# Altium schematic sheet Top Sheet.SchDoc
size A3; SheetNumber: 1; SheetTotal: 5
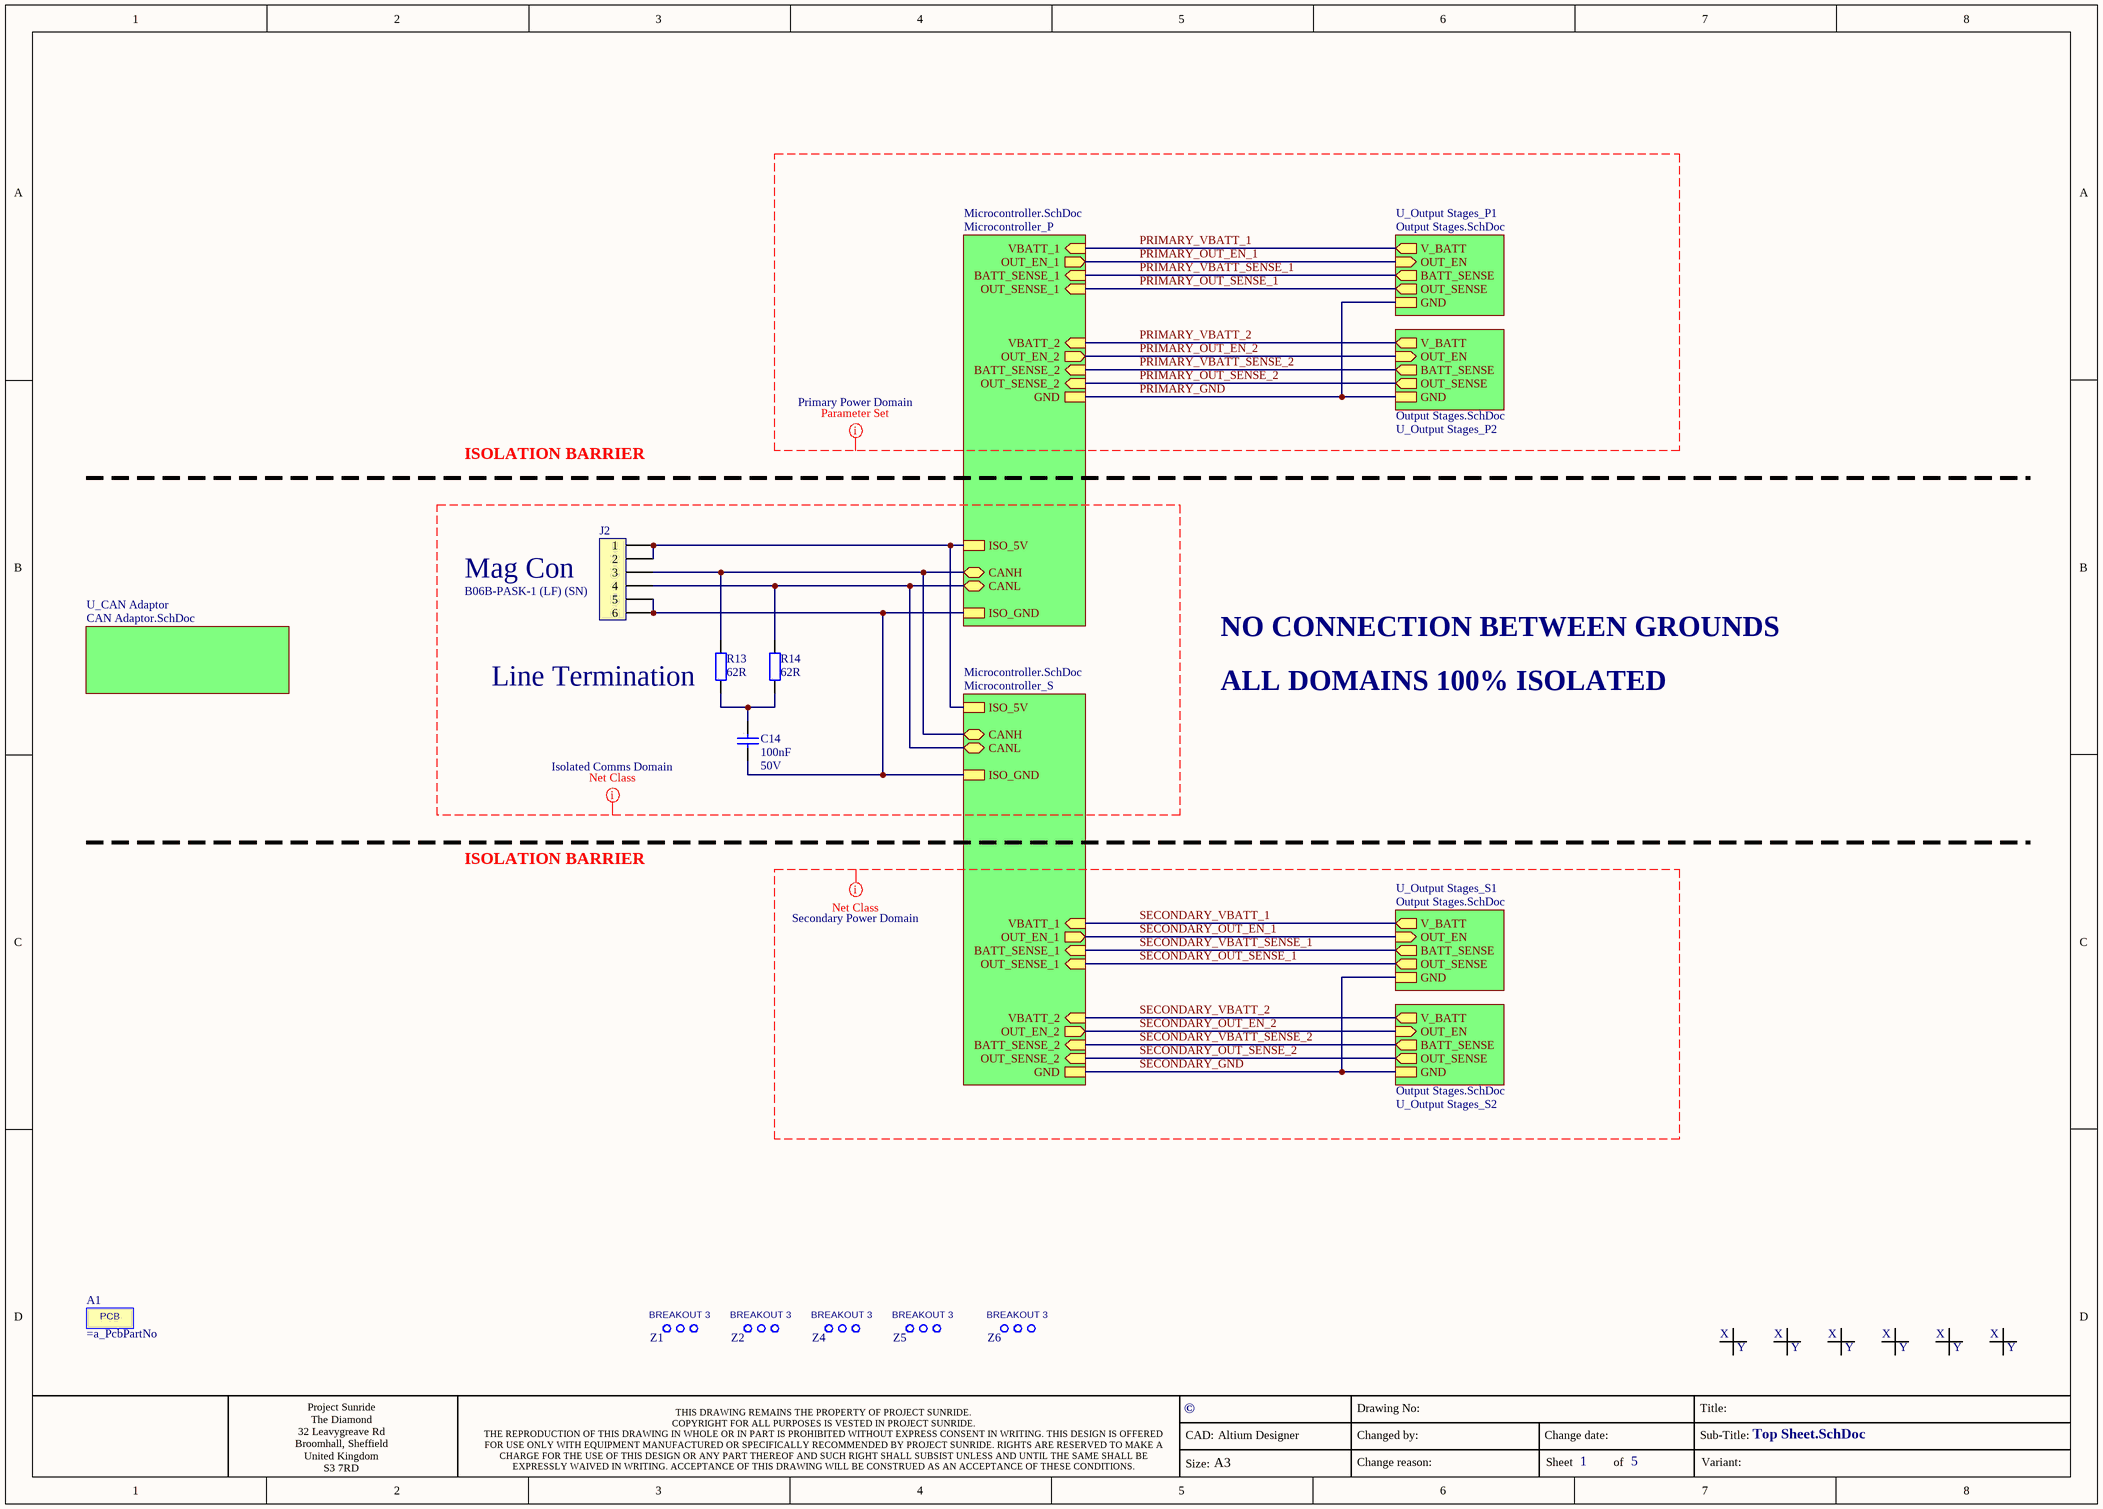
[diagram p0: Top Sheet.SchDoc]

## Parts
A1  *  [PCB]  (value not drawn)
C14  value 100nF  Voltage: 50V  [CAPC1608X08L]  (hidden comment: *)
FID1  *  [FIDRT]  (value not drawn)  (no BOM)
FID2  *  [FIDRT]  (value not drawn)  (no BOM)
FID3  *  [FIDRT]  (value not drawn)  (no BOM)
FID4  *  [FIDRT]  (value not drawn)  (no BOM)
FID5  *  [FIDRT]  (value not drawn)  (no BOM)
FID6  *  [FIDRT]  (value not drawn)  (no BOM)
J2  Mag Con  ManuPartNo: B06B-PASK-1 (LF) (SN)  [B06B-PASK-1]
R13  Line Termination  value 62R  [RESC1608X06L]
R14  value 62R  [RESC1608X06L]  (hidden comment: *)
Z1  *  [Breakout - 3 hole - short route]  (value not drawn)  (no BOM)
Z2  *  [Breakout - 3 hole - short route]  (value not drawn)  (no BOM)
Z4  *  [Breakout - 3 hole - short route]  (value not drawn)  (no BOM)
Z5  *  [Breakout - 3 hole - short route]  (value not drawn)  (no BOM)
Z6  *  [Breakout - 3 hole - short route]  (value not drawn)  (no BOM)

## Sub-sheets
Microcontroller_P = Microcontroller.SchDoc: OUT_EN_1 (out), OUT_EN_2 (out), BATT_SENSE_1 (in), BATT_SENSE_2 (in), VBATT_2 (in), VBATT_1 (in), OUT_SENSE_1 (in), OUT_SENSE_2 (in), CANH (bidir), CANL (bidir), GND, ISO_GND, ISO_5V
Microcontroller_S = Microcontroller.SchDoc: OUT_EN_1 (out), OUT_EN_2 (out), BATT_SENSE_1 (in), BATT_SENSE_2 (in), VBATT_2 (in), VBATT_1 (in), OUT_SENSE_1 (in), OUT_SENSE_2 (in), CANH (bidir), CANL (bidir), GND, ISO_GND, ISO_5V
U_CAN Adaptor = CAN Adaptor.SchDoc: no entries
U_Output Stages_P1 = Output Stages.SchDoc: OUT_EN (in), BATT_SENSE (out), V_BATT (out), OUT_SENSE (out), GND
U_Output Stages_P2 = Output Stages.SchDoc: OUT_EN (in), BATT_SENSE (out), V_BATT (out), OUT_SENSE (out), GND
U_Output Stages_S1 = Output Stages.SchDoc: OUT_EN (in), BATT_SENSE (out), V_BATT (out), OUT_SENSE (out), GND
U_Output Stages_S2 = Output Stages.SchDoc: OUT_EN (in), BATT_SENSE (out), V_BATT (out), OUT_SENSE (out), GND

## Nets
PRIMARY_GND: sheet Microcontroller_P/GND, sheet U_Output Stages_P1/GND, sheet U_Output Stages_P2/GND
PRIMARY_OUT_EN_1: sheet Microcontroller_P/OUT_EN_1, sheet U_Output Stages_P1/OUT_EN
PRIMARY_OUT_EN_2: sheet Microcontroller_P/OUT_EN_2, sheet U_Output Stages_P2/OUT_EN
PRIMARY_OUT_SENSE_1: sheet Microcontroller_P/OUT_SENSE_1, sheet U_Output Stages_P1/OUT_SENSE
PRIMARY_OUT_SENSE_2: sheet Microcontroller_P/OUT_SENSE_2, sheet U_Output Stages_P2/OUT_SENSE
PRIMARY_VBATT_1: sheet Microcontroller_P/VBATT_1, sheet U_Output Stages_P1/V_BATT
PRIMARY_VBATT_2: sheet Microcontroller_P/VBATT_2, sheet U_Output Stages_P2/V_BATT
PRIMARY_VBATT_SENSE_1: sheet Microcontroller_P/BATT_SENSE_1, sheet U_Output Stages_P1/BATT_SENSE
PRIMARY_VBATT_SENSE_2: sheet Microcontroller_P/BATT_SENSE_2, sheet U_Output Stages_P2/BATT_SENSE
SECONDARY_GND: sheet Microcontroller_S/GND, sheet U_Output Stages_S1/GND, sheet U_Output Stages_S2/GND
SECONDARY_OUT_EN_1: sheet Microcontroller_S/OUT_EN_1, sheet U_Output Stages_S1/OUT_EN
SECONDARY_OUT_EN_2: sheet Microcontroller_S/OUT_EN_2, sheet U_Output Stages_S2/OUT_EN
SECONDARY_OUT_SENSE_1: sheet Microcontroller_S/OUT_SENSE_1, sheet U_Output Stages_S1/OUT_SENSE
SECONDARY_OUT_SENSE_2: sheet Microcontroller_S/OUT_SENSE_2, sheet U_Output Stages_S2/OUT_SENSE
SECONDARY_VBATT_1: sheet Microcontroller_S/VBATT_1, sheet U_Output Stages_S1/V_BATT
SECONDARY_VBATT_2: sheet Microcontroller_S/VBATT_2, sheet U_Output Stages_S2/V_BATT
SECONDARY_VBATT_SENSE_1: sheet Microcontroller_S/BATT_SENSE_1, sheet U_Output Stages_S1/BATT_SENSE
SECONDARY_VBATT_SENSE_2: sheet Microcontroller_S/BATT_SENSE_2, sheet U_Output Stages_S2/BATT_SENSE
NetC14_1: C14.1 R13.1 R14.1
NetC14_2: C14.2 J2.5 J2.6 ; sheet Microcontroller_P/ISO_GND, sheet Microcontroller_S/ISO_GND
NetJ2_1: J2.1 J2.2 ; sheet Microcontroller_P/ISO_5V, sheet Microcontroller_S/ISO_5V
NetJ2_3: J2.3 R13.2 ; sheet Microcontroller_P/CANH, sheet Microcontroller_S/CANH
NetJ2_4: J2.4 R14.2 ; sheet Microcontroller_P/CANL, sheet Microcontroller_S/CANL

## Layout directives
net class Isolated Comms Domain: (no net found under the mark)
net class Secondary Power Domain: SECONDARY_GND, SECONDARY_OUT_EN_1, SECONDARY_OUT_EN_2, SECONDARY_OUT_SENSE_1, SECONDARY_OUT_SENSE_2, SECONDARY_VBATT_1, SECONDARY_VBATT_2, SECONDARY_VBATT_SENSE_1, SECONDARY_VBATT_SENSE_2
net class Primary Power Domain; net class Primary Power Domain: PRIMARY_GND, PRIMARY_OUT_EN_1, PRIMARY_OUT_EN_2, PRIMARY_OUT_SENSE_1, PRIMARY_OUT_SENSE_2, PRIMARY_VBATT_1, PRIMARY_VBATT_2, PRIMARY_VBATT_SENSE_1, PRIMARY_VBATT_SENSE_2

## Notes on the sheet
- ISOLATION BARRIER
- NO CONNECTION BETWEEN GROUNDS
- ALL DOMAINS 100% ISOLATED
- ©
- CAD:
- Altium Designer
- Changed by:
- Drawing No:
- Change date:
- Title:
- Sub-Title:
- Project Sunride
  The Diamond
  32 Leavygreave Rd
  Broomhall, Sheffield
  United Kingdom
  S3 7RD
- THIS DRAWING REMAINS THE PROPERTY OF PROJECT SUNRIDE.
  COPYRIGHT FOR ALL PURPOSES IS VESTED IN PROJECT SUNRIDE.
  THE REPRODUCTION OF THIS DRAWING IN WHOLE OR IN PART IS PROHIBITED WITHOUT EXPRESS CONSENT IN WRITING. THIS DESIGN IS OFFERED FOR USE ONLY WITH EQUIPMENT MANUFACTURED OR SPECIFICALLY RECOMMENDED BY PROJECT SUNRIDE. RIGHTS ARE RESERVED TO MAKE A CHARGE FOR THE USE OF THIS DESIGN OR ANY PART THEREOF AND SUCH RIGHT SHALL SUBSIST UNLESS AND UNTIL THE SAME SHALL BE EXPRESSLY WAIVED IN WRITING. ACCEPTANCE OF THIS DRAWING WILL BE CONSTRUED AS AN ACCEPTANCE OF THESE CONDITIONS.
- Size:
- A3
- Change reason:
- Sheet
- of
- Variant:
- (in symbol Misc FIDT) X; Y
- (in symbol Misc_Breakout - 3 hole - short route) BREAKOUT 3

## Library data of the parts
A1 = Misc PCB: PCB (Bare Board); Class: PCB BOM Entry; Supplier Part Number 1: =a_PcbPartNo; Source: Misc PCB; Created: 31/05/2013; Last_Updated: 31/05/2013; Notes: -
C14 = FEC882-0023: Capacitor MLC 100nF 50V X7R 10% CAPC1608X08M; Manufacturer: Murata; ManuPartNo: GRM188R71H104KA93D; Cost 1+: 0.064; Cost 1K+: 0.039; Life: V; Source: FEC882-0023; Dielectric: X7R; Tolerance: 10%; Class: Capacitor MLC; RoHS: Y; Created: 25/01/2013; Last_Updated: 25/01/2013; Supplier 1: Farnell; Supplier Part Number 1: 8820023
FID1-FID6 = Misc FIDT: Fiducial 1mm Dot Component Side; Class: Fiducial Dot; Source: Misc FIDT; Supplier 1: Misc; Supplier Part Number 1: FIDT; Created: 31/05/2013; Last_Updated: 31/05/2013
J2 = FEC183-0743: Connector 6 Way Vertical B06B-PASK-1 (LF) (SN) 2mm Pitch; Manufacturer: JST; Cost 1+: 0.55; Cost 1K+: 0.2; Life: V; Source: FEC183-0743; Pin Count: 6; Orient: Vertical; Supplier 1: Farnell; Supplier Part Number 1: 1830743; Pitch: 2mm; Class: Connector; RoHS: Y; Created: 21/06/2013; Last_Updated: 21/06/2013
R13 R14 = Mouser603-RC0603FR-0762RL: SMD Chip Resistor, Thick Film, 62 ohm, 75V, 0603 [1608 Metric], 100mW, ± 1%, RC Series; Manufacturer: Yageo; Cost 1+: 0.074; Cost 1K+: 0.002; Life: V; Source: Mouser603-RC0603FR-0762RL; Voltage: 75V; Power: 100mW; ManuPartNo: RC0603FR-0762RL; Supplier 1: Mouser; Supplier Part Number 1: 603-RC0603FR-0762RL; Tolerance: 1%; Class: Resistor; RoHS: Y; Created: 08/06/2018; Last_Updated: 08/06/2018; ComponentLink1Description: Datasheet; ComponentLink1URL: C:\Altium SANDBOX\Component Database\Datasheet\Yageo RC_L Series.pdf
Z1 Z2 Z4-Z6 = Misc_Breakout - 3 hole - short route: Breakout - 3 hole - short route; Class: Free pads; Source: Misc_Breakout - 3 hole - short route; Supplier 1: Misc; Created: 14/12/2020; Last_Updated: 14/12/2020